# Altium schematic sheet STLink.SchDoc
size A
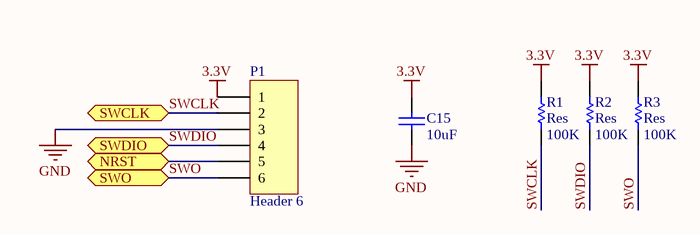
[diagram p0: STLink.SchDoc]

## Parts
C15  value 10uF  [2012[0805]]  (hidden comment: Cap_UP)
P1  Header 6  [HDR1X6]
R1  Res  value 100K  [2012[0805]]
R2  Res  value 100K  [2012[0805]]
R3  Res  value 100K  [2012[0805]]

## Ports
NRST, SWCLK, SWDIO, SWO

## Nets
3.3V: C15.2 P1.1 R1.2 R2.2 R3.2
GND: C15.1 P1.3
NRST: P1.5 ; port NRST
SWCLK: P1.2 R1.1 ; port SWCLK
SWDIO: P1.4 R2.1 ; port SWDIO
SWO: P1.6 R3.1 ; port SWO

## Library data of the parts
C15 = Cap_UP: Capacitor; Published: 8-Jun-2000; LatestRevisionDate: 17-Jul-2002; LatestRevisionNote: Re-released for DXP Platform.; PackageReference: RAD-0.3; Publisher: Altium Limited
P1 = Header 6: Header, 6-Pin; LatestRevisionDate: 17-Jul-2002; LatestRevisionNote: Re-released for DXP Platform.; Publisher: Altium Limited
R1-R3 = Res: Semiconductor Resistor; Published: 8-Jun-2000; LatestRevisionDate: 17-Jul-2002; LatestRevisionNote: Re-released for DXP Platform.; PackageReference: AXIAL-0.5; Publisher: Altium Limited